# Altium project PCB_Project_1.PrjPcb
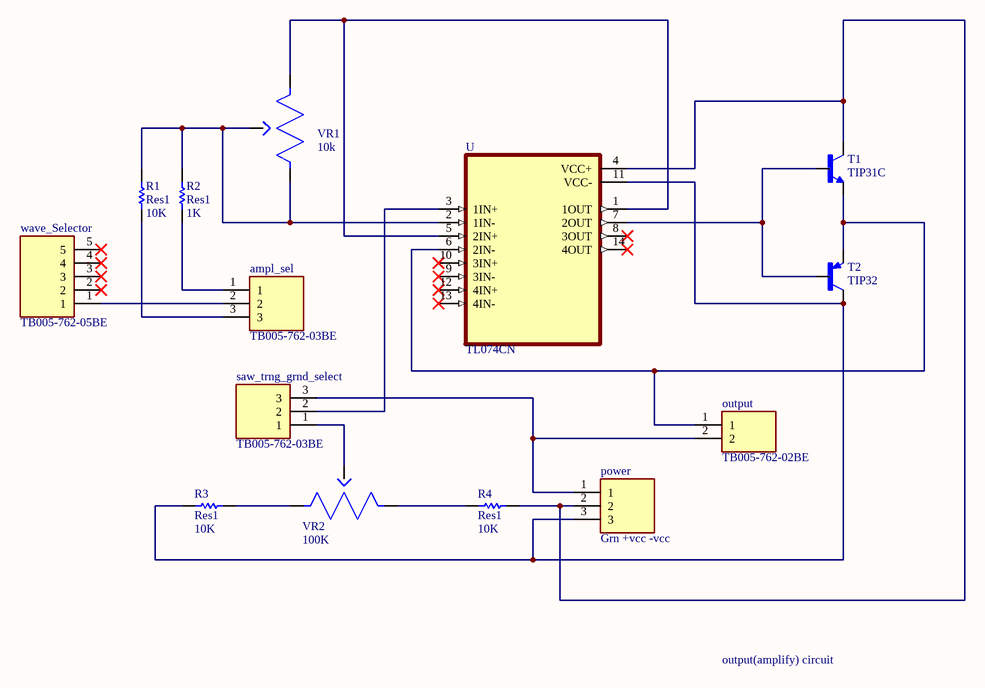
[diagram p0: sche_out.SchDoc]
1 sheet, 14 parts. Net scope: global (net labels, ports and power ports of the same name join across sheets).
Board file: pcb_out.PcbDoc

## Sheet sche_out.SchDoc
size A

### Parts
ampl_sel  TB005-762-03BE  [CUI_TB005-762-03BE]
output  TB005-762-02BE  [CUI_TB005-762-02BE]
power  Grn +vcc -vcc  [CUI_TB005-762-03BE]
R1  Res1  value 10K  [AXIAL-0.3]
R2  Res1  value 1K  [AXIAL-0.3]
R3  Res1  value 10K  [AXIAL-0.3]
R4  Res1  value 10K  [AXIAL-0.3]
saw_trng_grnd_select  TB005-762-03BE  [CUI_TB005-762-03BE]
T1  TIP31C  [TO220]
T2  TIP32  [TO220]
U  TL074CN  [DIP794W45P254L1969H508Q14]
VR1  10k  [P160]
VR2  100K  [P160]
wave_Selector  TB005-762-05BE  [CUI_TB005-762-05BE]

### Nets
Netampl_sel_1: ampl_sel.1 R2.1
Netampl_sel_2: ampl_sel.2 wave_Selector.1
Netampl_sel_3: ampl_sel.3 R1.1
Netoutput_1: output.1 T1.3(E) T2.3(E) U.6(2IN-)
Netoutput_2: output.2 power.1 saw_trng_grnd_select.3
Netpower_2: power.2 R4.2 T1.2(C) U.4(VCC+)
Netpower_3: power.3 R3.1 T2.2(C) U.11(VCC-)
NetR1_2: R1.2 R2.2 U.2(1IN-) VR1.2 VR1.3
NetR3_2: R3.2 VR2.3
NetR4_1: R4.1 VR2.1
Netsaw_trng_grnd_select_1: saw_trng_grnd_select.1 VR2.2
Netsaw_trng_grnd_select_2: saw_trng_grnd_select.2 U.3(1IN+)
NetT1_1: T1.1(B) T2.1(B) U.7(2OUT)
NetU_1: U.1(1OUT) U.5(2IN+) VR1.1

Not connected (* = marked no-connect by the designer): U 8(3OUT)* 9(3IN-)* 10(3IN+)* 12(4IN+)* 13(4IN-)* 14(4OUT)*; wave_Selector 2* 3* 4* 5*

### Notes on the sheet
- output(amplify) circuit

### Library data of the parts
ampl_sel power saw_trng_grnd_select = TB005-762-03BE: 2~24 Poles, Screw Type, Horizontal, 7.62 Pitch, 26~10 _AWG_, Terminal Block Connector; MF: CUI Devices; CUI_purchase_URL: https://www.cuidevices.com/product/interconnect/connectors/terminal-blocks/tb005-762-series?utm_source=snapeda.com&utm_medium=referral&utm_campaign=snapedaBOM; MP: TB005-762-03BE; SnapEDA_Link: https://www.snapeda.com/parts/TB005-762-03BE/CUI%20Devices/view-part/3590987/?ref=snap; Price: None; Package: None; Availability: Unavailable; Value: *
output = TB005-762-02BE: 2~24 Poles, Screw Type, Horizontal, 7.62 Pitch, 26~10 _AWG_, Terminal Block Connector; MF: CUI Devices; SnapEDA_Link: https://www.snapeda.com/parts/TB005-762-02BE/CUI%20Devices/view-part/3590982/?ref=snap; Price: None; Availability: Unavailable; Package: None; MP: TB005-762-02BE; Value: *
R1-R4 = Res1: Resistor; Published: 8-Jun-2000; LatestRevisionDate: 17-Jul-2002; LatestRevisionNote: Re-released for DXP Platform.; PackageReference: AXIAL-0.3; Publisher: Altium Limited; PackageDescription: Axial Device, Thru-Hole; 2 Leads; 0.3 in Pin Spacing
T1 = TIP31C: Bipolar _BJT_ Transistor NPN 100V 3A 3MHz 2W Through Hole TO-220AB; MF: Renesas Electronics; Availability: Unavailable; SnapEDA_Link: https://www.snapeda.com/parts/TIP31C/Renesas%20Electronics%20America%20Inc./view-part/1915707/?ref=snap; Value: *; Price: None; Package: TO-220 Multicomp; MP: TIP31C
T2 = TIP32: Bipolar _BJT_ Transistor PNP 40V 3A 3MHz 2W Through Hole TO-220-3; MF: ON Semiconductor; Price: None; SnapEDA_Link: https://www.snapeda.com/parts/TIP32/ON%20Semiconductor/view-part/4572277/?ref=snap; MP: TIP32; Availability: Unavailable; Value: *; Package: TO-220 ON Semiconductor
U = TL074CN: Quad Low-Noise JFET-Input General-Purpose Operational Amplifier 14-PDIP 0 to 70; MF: Texas Instruments; SnapEDA_Link: https://www.snapeda.com/parts/TL074CN/Texas%20Instruments/view-part/4796371/?ref=snap; Price: None; Mouser-Purchase-URL: https://snapeda.com/shop?store=Mouser&id=4796371; Package: PDIP-14 Texas Instruments; Availability: Good; Texas_Instruments-Purchase-URL: https://snapeda.com/shop?store=Texas+Instruments&id=4796371; MP: TL074CN; DigiKey-Purchase-URL: https://snapeda.com/shop?store=DigiKey&id=4796371; Value: *
VR1 VR2 = P160KN-0QC15B500K: 500k Ohm 1 Gang Linear Panel Mount Potentiometer None 1 Turn Conductive Plastic 0.2W, 1/5W PC Pins; MF: TT Electronics/BI; Value: *; Digi-Key_Part_Number: 987-1304-ND; Package: None; Digi-Key_Purchase_URL: https://www.digikey.cz/product-detail/en/tt-electronics-bi/P160KN-0QC15B500K/987-1304-ND/2408881?utm_source=snapeda&utm_medium=aggregator&utm_campaign=symbol; MP: P160KN-0QC15B500K; SnapEDA_Link: https://www.snapeda.com/parts/P160KN-0QC15B500K/TT%20Electronics/BI/view-part/903272/?ref=snap
wave_Selector = TB005-762-05BE: 2~24 Poles, Screw Type, Horizontal, 7.62 Pitch, 26~10 (AWG), Terminal Block Connector; MF: CUI Devices; Value: *; CUI_purchase_URL: https://www.cuidevices.com/product/interconnect/connectors/terminal-blocks/tb005-762-series?utm_source=snapeda.com&utm_medium=referral&utm_campaign=snapedaBOM; SnapEDA_Link: https://www.snapeda.com/parts/TB005-762-05BE/CUI%20Devices/view-part/3590997/?ref=snap; Availability: Unavailable; MP: TB005-762-05BE; Package: None; Price: None; Check_prices: https://www.snapeda.com/parts/TB005-762-05BE/CUI%20Devices/view-part/3590997/?ref=eda